# Altium schematic sheet PAGE2-BLE, POWER, LORA.SchDoc (part 3 of 3)
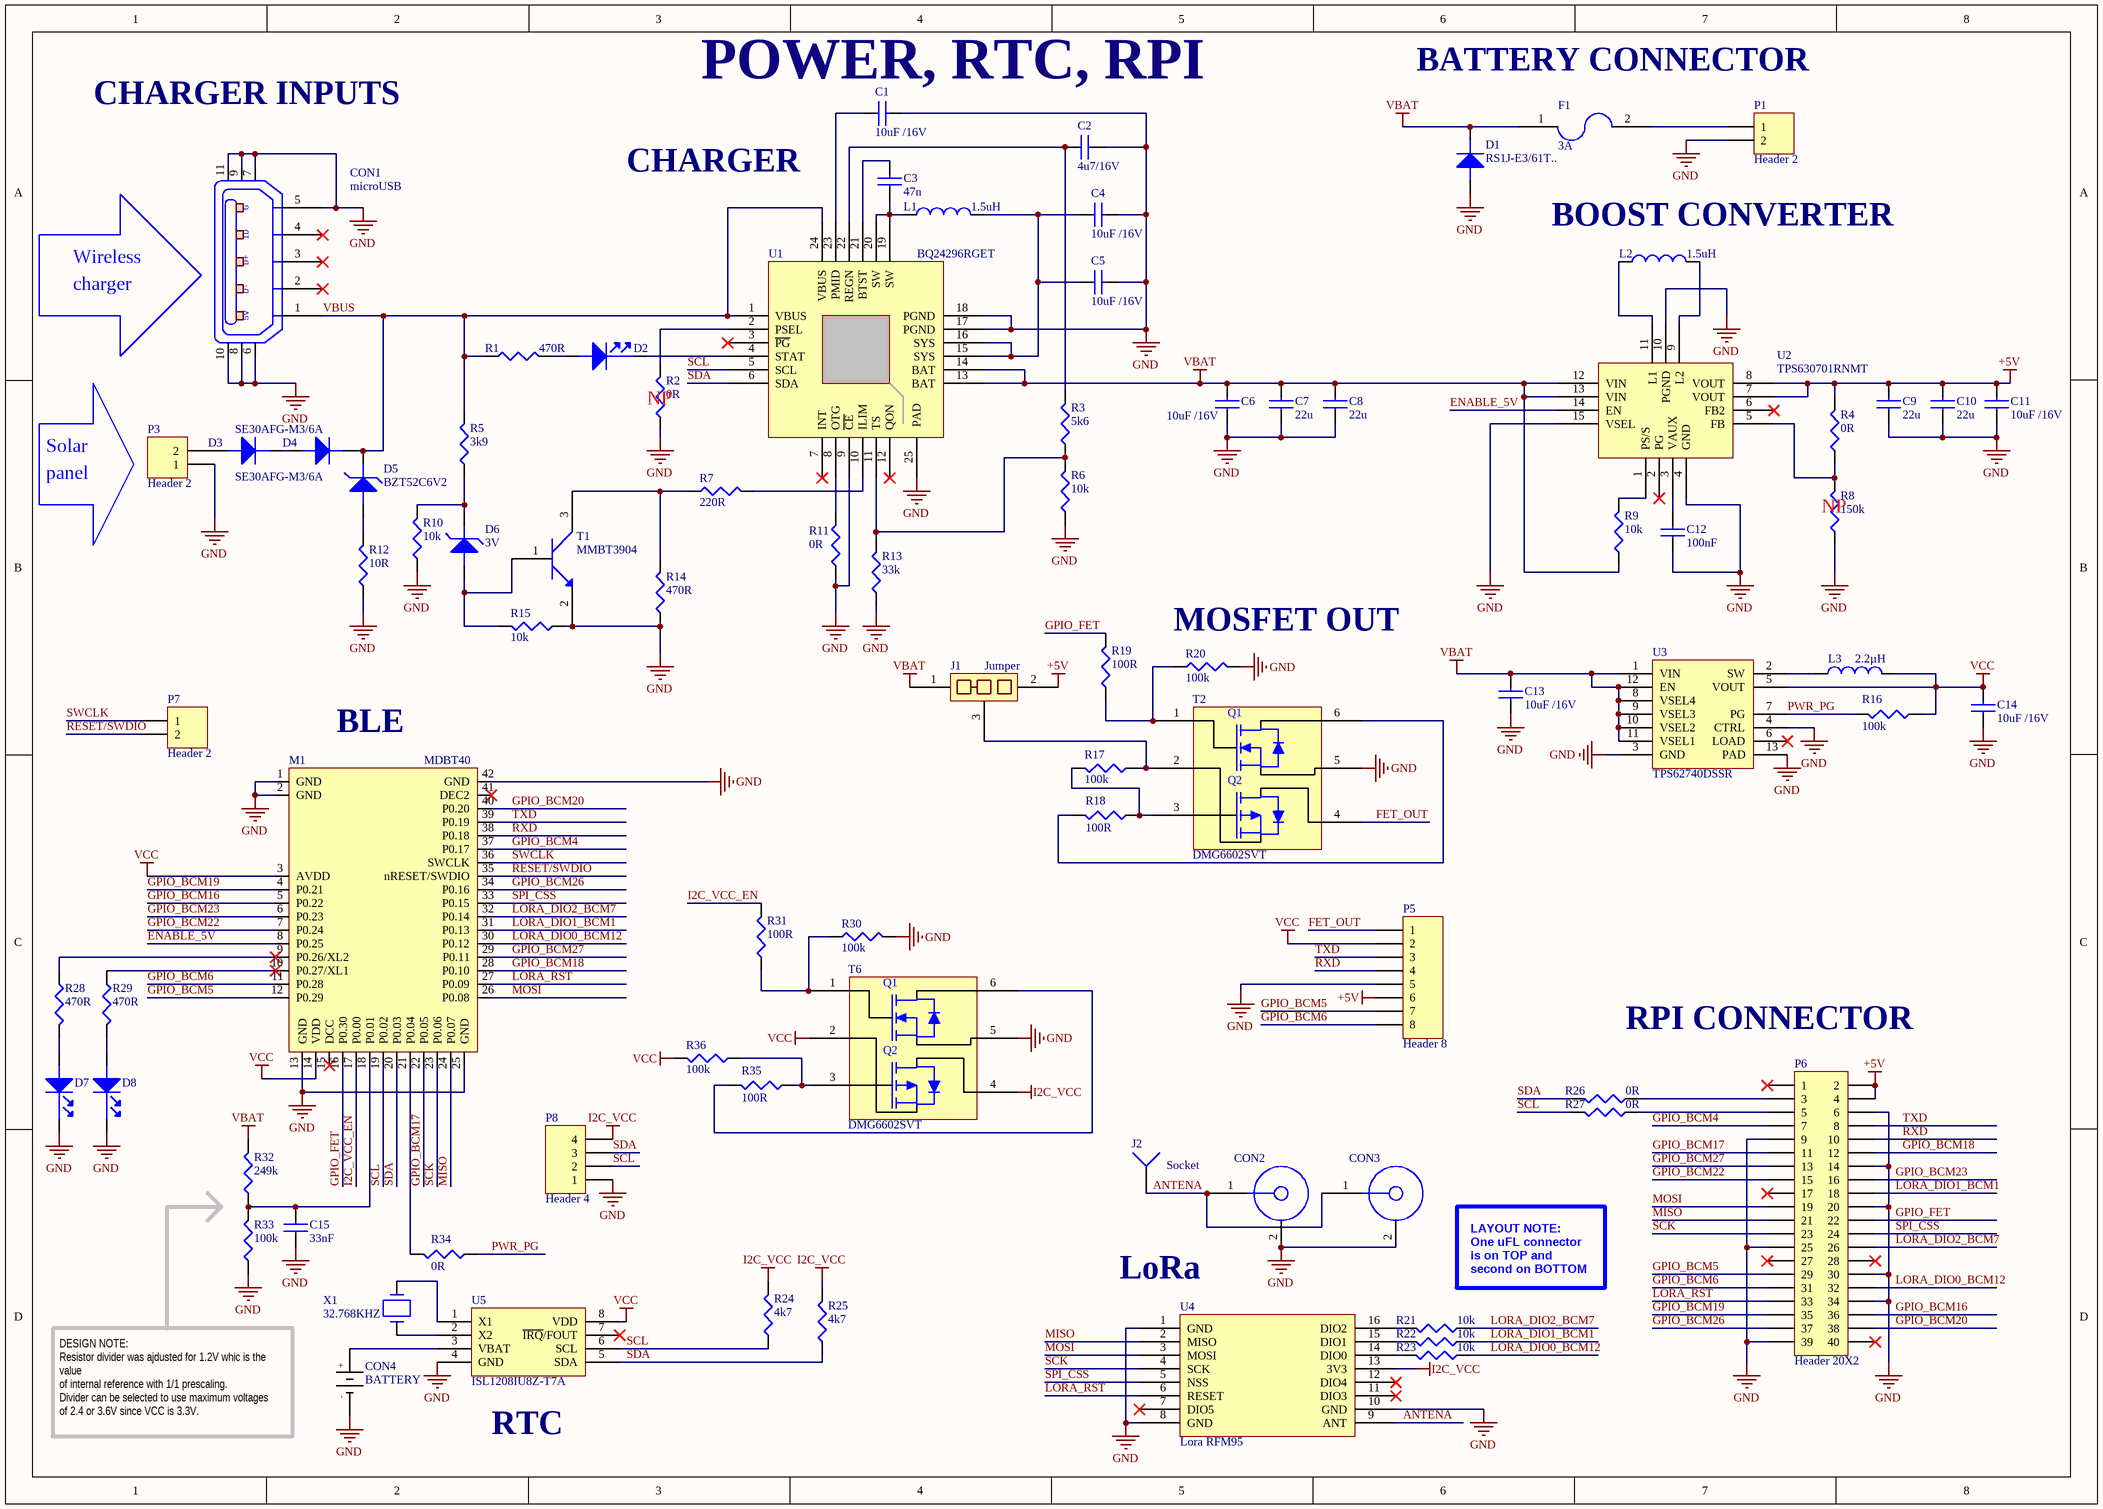
[diagram p2: PAGE2-BLE, POWER, LORA.SchDoc]

## Library data of the parts (continued)
U2 = TPS630701RNMT: TEXAS INSTRUMENTS - TPS630701RNMT - DC/DC CONV, BUCK-BOOST, 2.4MHZ, VQFN-15; Input Voltage Min: 2; Input Voltage Max: 16; DC / DC Converter IC Case: VQFN; No. of Pins: 15; Output Voltage Nom.: 5; Switching Frequency: 2.4; SVHC: No SVHC (17-Dec-2015; Supplier 1: Farnell; Manufacturer: TEXAS INSTRUMENTS; Manufacturer Part Number: TPS630701RNMT; RoHS: YES; Stock 1: 456; Pricing 1: 1=2.23, 10=1.87, 100=1.7, 250=1.56, 500=1.47, 1000=1.21 (GBP); Topology: Buck-Boost; Output Current: 2; Operating Temperature Max: 125; Packaging: Cut Tape; Product Range: -; Automotive Qualification Standard: -; MSL: MSL 1 - Unlimited; ComponentLink1URL: http://www.ti.com/general/docs/lit/getliterature.tsp?genericPartNumber=TPS63070&fileType=pdf; ComponentLink1Description: http://www.ti.com/general/docs/lit/getliterature.tsp?genericPartNumber=TPS63070&fileType=pdf; Supplier Part Number 1: 2643432
U3 = TPS62740DSSR: Voltage Regulators - Switching Regulators 360-nA Iq SD Cnvtr w/ Intg Load Switch; Manufacturer: Texas Instruments; Number of Outputs: 1; Output Voltage: 3.3V; Max Output Current: 300mA; Min Input Voltage: 2.2V; Max Input Voltage: 5.5V; Efficiency: 90%; Switching Frequency: 2MHz; Min Output Voltage: 1.8V; Quiescent Current: 300nA; Supplier 1: Farnell; Manufacturer Part Number: TPS62740DSSR; Stock 1: 2440; Pricing 1: 5=1.44, 50=1.1, 250=1.05, 500=0.707, 1500=0.688 (EUR); Mount: Surface Mount; Number of Pins: 12; Min Operating Temperature: -40°C; Max Operating Temperature: 85°C; Package Quantity: 3000; Packaging: Tape and Reel; Output Current: 300mA; Min Supply Voltage: 2.2V; Operating Supply Current: 300mA; Max Output Voltage: 3.3V; Operating Supply Voltage: 5.5V; Radiation Hardening: No; REACH SVHC: No SVHC; Lead Free: Lead Free; ComponentLink1URL: https://datasheet.ciiva.com/29899/tps62740-29899468.pdf; ComponentLink1Description: https://datasheet.ciiva.com/29899/tps62740-29899468.pdf; ComponentLink2URL: https://datasheet.ciiva.com/29567/tps62740-29567318.pdf; ComponentLink2Description: https://datasheet.ciiva.com/29567/tps62740-29567318.pdf; Supplier Part Number 1: 2781752
U4 = Lora RFM95 868M: RFM95 ULTRA-LONG RANGE TRANSCEIV; Manufacturer: Seeed Technology Co., Ltd; Manufacturer Part Number: 109990166; RF Family/Standard: General ISM < 1GHz; Protocol: LoRa™; Modulation: FSK, GFSK, GMSK, MSK, OOK; Frequency: 868MHz; Data Rate: 300kbps; Power - Output: 20dBm; Sensitivity: -148dBm; Serial Interfaces: SPI; Voltage - Supply: 1.8 V ~ 3.7 V; Current - Receiving: 12.1mA; Current - Transmitting: 120mA; Supplier 1: Digi-Key; RoHS: Not Applicable; Category: RF/IF and RFID; Stock 1: 211; Pricing 1: 1=7.09 (USD); Packaging: Bulk; Part Status: Active; Antenna Type: -; Memory Size: -; Mounting Type: Surface Mount; Operating Temperature: -20°C ~ 70°C; Package / Case: Module; ComponentLink1URL: https://github.com/SeeedDocument/RFM95-98_LoRa_Module/blob/master/RFM95_96_97_98_DataSheet.pdf; ComponentLink1Description: https://github.com/SeeedDocument/RFM95-98_LoRa_Module/blob/master/RFM95_96_97_98_DataSheet.pdf; Supplier Part Number 1: 1597-1488-ND
U5 = ISL1208IU8Z-T7A: IC RTC/CALENDAR I2C LP 8MSOP; Manufacturer: Intersil; Max Supply Voltage: 5.5V; Min Supply Voltage: 2.7V; Non-volatile Memory Size: 2B; Interface: I2C,Serial,2-Wire; Logic Function: Clock; Time Format: HH:MM:SS; Date Format: YY-MM-DD-dd; Supplier 1: Farnell; Manufacturer Part Number: ISL1208IU8Z-T7A; Stock 1: 321; Pricing 1: 1=2.63, 10=2.24, 25=2.12, 50=2.01, 100=1.89, 250=1.84, 500=1.65, 1000=1.37 (EUR); Mount: Surface Mount; Case/Package: MSOP; Number of Pins: 8; Min Operating Temperature: -40°C; Max Operating Temperature: 85°C; Packaging: Tape and Reel; Package Quantity: 250; Memory Size: 2B; Radiation Hardening: No; REACH SVHC: Unknown; Lead Free: Lead Free; ComponentLink1URL: https://datasheet.ciiva.com/16293/fn8085-16293145.pdf; ComponentLink1Description: https://datasheet.ciiva.com/16293/fn8085-16293145.pdf; ComponentLink2URL: https://datasheet.ciiva.com/8145/fn8085-8145071.pdf; ComponentLink2Description: https://datasheet.ciiva.com/8145/fn8085-8145071.pdf; ComponentLink3URL: https://datasheet.ciiva.com/6668/fn8085-6668119.pdf; ComponentLink3Description: https://datasheet.ciiva.com/6668/fn8085-6668119.pdf; ComponentLink4URL: https://datasheet.ciiva.com/6668/fn8085-6668117.pdf; ComponentLink4Description: https://datasheet.ciiva.com/6668/fn8085-6668117.pdf; ComponentLink5URL: https://datasheet.ciiva.com/6668/fn8085-6668118.pdf; ComponentLink5Description: https://datasheet.ciiva.com/6668/fn8085-6668118.pdf; Supplier Part Number 1: 2543322
X1 = LFXTAL009678: CRYSTAL, 32.768KHZ, 12.5PF, SMD; Manufacturer: IQD; Frequency: 32.8kHz; Supplier 1: Farnell; Manufacturer Part Number: LFXTAL009678; Stock 1: 15609; Pricing 1: 5=0.283, 50=0.203, 250=0.169, 500=0.163, 1500=0.157, 3000=0.152, 15000=0.146 (EUR); Case/Package: 217; Number of Pins: 2; Min Operating Temperature: -40°C; Max Operating Temperature: 85°C; Load Capacitance: 12.5pF; REACH SVHC: No SVHC; ComponentLink1URL: https://datasheet.ciiva.com/46419/1852967-46419749.pdf; ComponentLink1Description: https://datasheet.ciiva.com/46419/1852967-46419749.pdf; Supplier Part Number 1: 2449398
J2 = Socket: LatestRevisionDate: 17-Jul-2002; LatestRevisionNote: Re-released for DXP Platform.; Publisher: Altium Limited